# EAGLE design avr_keyboard_toy (EAGLE 7.7.0)
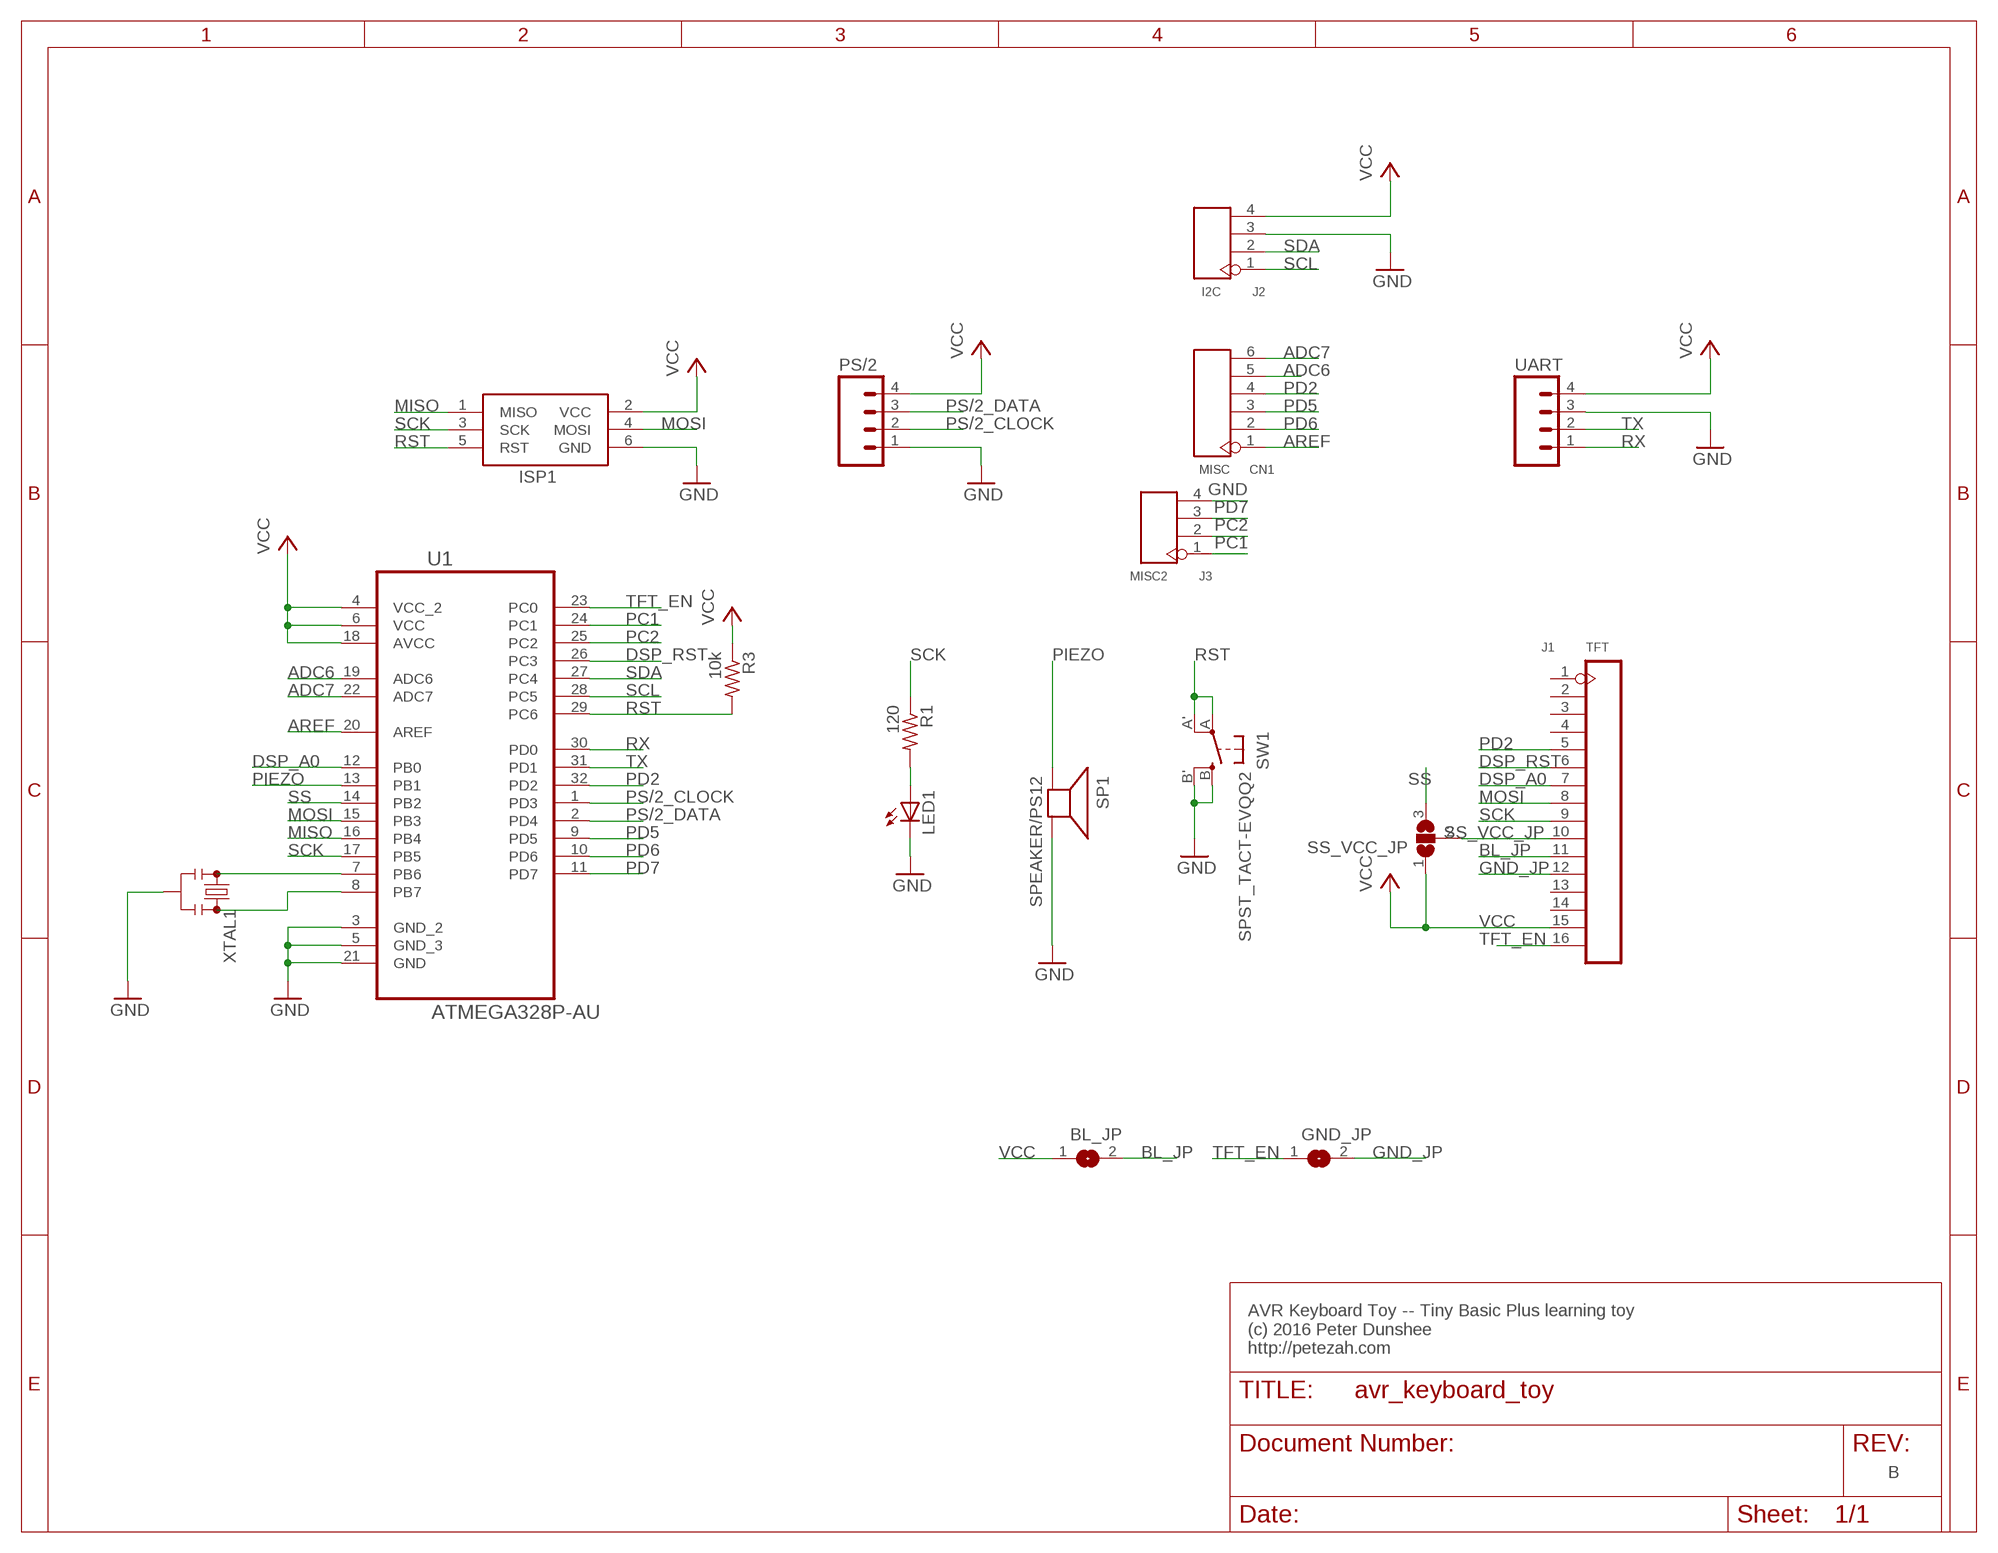
[diagram p0: schematic, sheet 1]

## Parts
BL_JP  SJ  [SJ]
CN1  MISC  DIP-BLACK-FEMALE-HEADER-VERT(6P-2.54)  [H6-2.54]
GND_JP  SJ  [SJ]
ISP1  AVRISP-6  [AVRISP]
J1  TFT  DIP-BLACK-FEMALE-HEADER-VERT(16P-2.54)  [H16-2.54]
J2  I2C  DIP-BLACK-FEMALE-HEADER-VERT(4P-2.54)  [H4-2.54]
J3  MISC2  DIP-BLACK-FEMALE-HEADER-VERT(4P-2.54)  [H4-2.54]
LED1  LEDCHIPLED_1206  [CHIPLED_1206]
PS/2  M04PTH  [1X04]
R1  120  R-US_R1206  [R1206]
R3  10k  R-US_R1206  [R1206]
SP1  SPEAKER/PS12  [PS12]
SS_VCC_JP  SJ2W  [SJ_2]
SW1  SPST_TACT-EVQQ2  [EVQ-Q2]
U1  ATMEGA328P-AU  [QFP80P900X900X120-32N]
UART  M04PTH  [1X04]
XTAL1  RESONATORPTH  [RESONATOR-PTH]

## Nets
ADC6: CN1.5 U1.19(ADC6)
ADC7: CN1.6 U1.22(ADC7)
AREF: CN1.1 U1.20(AREF)
BL_JP: BL_JP.2 J1.11
DSP_A0: J1.7 U1.12(PB0)
DSP_RST: J1.6 U1.26(PC3)
GND: ISP1.6(GND) J2.3 J3.4 LED1.C PS/2.1 SP1.P$2(-) SW1.B'(S1) SW1.B(S) U1.3(GND_2) U1.5(GND_3) U1.21(GND) UART.3 XTAL1.2
GND_JP: GND_JP.2 J1.12
MISO: ISP1.1(MISO) U1.16(PB4)
MOSI: ISP1.4(MOSI) J1.8 U1.15(PB3)
N$1: U1.7(PB6) XTAL1.1
N$2: U1.8(PB7) XTAL1.3
N$3: LED1.A R1.2
PC1: J3.1 U1.24(PC1)
PC2: J3.2 U1.25(PC2)
PD2: CN1.4 J1.5 U1.32(PD2)
PD5: CN1.3 U1.9(PD5)
PD6: CN1.2 U1.10(PD6)
PD7: J3.3 U1.11(PD7)
PIEZO: SP1.P$1(+) U1.13(PB1)
PS/2_CLOCK: PS/2.2 U1.1(PD3)
PS/2_DATA: PS/2.3 U1.2(PD4)
RST: ISP1.5(RST) R3.2 SW1.A'(P1) SW1.A(P) U1.29(PC6)
RX: U1.30(PD0) UART.1
SCK: ISP1.3(SCK) J1.9 R1.1 U1.17(PB5)
SCL: J2.1 U1.28(PC5)
SDA: J2.2 U1.27(PC4)
SS: SS_VCC_JP.3 U1.14(PB2)
SS_VCC_JP: J1.10 SS_VCC_JP.2
TFT_EN: GND_JP.1 J1.16 U1.23(PC0)
TX: U1.31(PD1) UART.2
VCC: BL_JP.1 ISP1.2(VCC) J1.15 J2.4 PS/2.4 R3.1 SS_VCC_JP.1 U1.4(VCC_2) U1.6(VCC) U1.18(AVCC) UART.4
Unconnected: J1.1 J1.2 J1.3 J1.4 J1.13 J1.14

## Notes on the sheet
- AVR Keyboard Toy -- Tiny Basic Plus learning toy
  (c) 2016 Peter Dunshee
  http://petezah.com
- B

## Library data of the parts
BL_JP GND_JP = jumper:SJ: SMD solder JUMPER
CN1 = Seeed-Connector -2016:DIP-BLACK-FEMALE-HEADER-VERT(6P-2.54): 320030060; MPN: F185-1106A1BSYC1; VALUE: 6p-2.54
ISP1 = adafruit:AVRISP: AVR ISP HEADER Standard 6 pin header for AVR programming
J1 = Seeed-OPL-Connector:DIP-BLACK-FEMALE-HEADER-VERT(16P-2.54): 320030078; MPN: F185-1116A0BSYA1; VALUE: black-16p-2.54
J2 J3 = Seeed-Connector -2016:DIP-BLACK-FEMALE-HEADER-VERT(4P-2.54): 320030017; MPN: F185-1104A1BSYA1; VALUE: 4p-2.54
LED1 = adafruit:LED: LED OSRAM: - CHIPLED LG R971, LG N971, LY N971, LG Q971, LY Q971, LO R971, LY R971 LH N974, LH R974 LS Q976, LO Q976, LY Q976 LO Q996 - Hyper CHIPLED LW Q18S LB Q993, LB Q99A, LB R99A - SideLED LS A670, LO A670, LY A670, LG A670, LP A670 LB A673, LV A673, LT A673, LW A673 LH A674 LY A675 LS A676, LA A676, LO A676, LY A676, LW A676 LS A679, LY A679, LG A679 - Hyper Micro SIDELED® LS Y876, LA Y876, LO Y876, LY Y876 LT Y87S - SmartLED LW L88C, LW L88S LB L89C, LB L89S, LG L890 LS L89K, LO L89K, LY L89K LS L896, LA L896, LO L896, LY L896 - TOPLED LS T670, LO T670, LY T670, LG T670, LP T670 LSG T670, LSP T670, LSY T670, LOP T670, LYG T670 LG T671, LOG T671, LSG T671 LB T673, LV T673, LT T673, LW T673 LH T674 LS T676, LA T676, LO T676, LY T676, LB T676, LH T676, LSB T676, LW T676 LB T67C, LV T67C, LT T67C, LS T67K, LO T67K, LY T67K, LW E67C LS E67B, LA E67B, LO E67B, LY E67B, LB E67C, LV E67C, LT E67C LW T67C LS T679, LY T679, LG T679 LS T770, LO T770, LY T770, LG T770, LP T770 LB T773, LV T773, LT T773, LW T773 LH T774 LS E675, LA E675, LY E675, LS T675 LS T776, LA T776, LO T776, LY T776, LB T776 LHGB T686 LT T68C, LB T68C - Hyper Mini TOPLED® LB M676 - Mini TOPLED Santana® LG M470 LS M47K, LO M47K, LY M47K Source: http://www.osram.convergy.de/
PS/2 UART = SparkFun-Connectors:M04: Header 4 Standard 4-pin 0.1" header. Use with straight break away headers (SKU : PRT-00116), right angle break away headers (PRT-00553), swiss pins (PRT-00743), machine pins (PRT-00117), and female headers (PRT-00115). Molex polarized connector foot print use with SKU : PRT-08231 with associated crimp pins and housings. 1MM SMD Version SKU: PRT-10208; PROD_ID: CONN-09696
R1 R3 = adafruit:R-US_: RESISTOR, American symbol
SP1 = adafruit:SPEAKER: SPEAKER Source: Buerklin Added PS12 (for part # PS1240 piezo) http://www.ladyada.net/library/pcb/eaglelibrary.html
SS_VCC_JP = jumper:SJ2W: SMD solder JUMPER
SW1 = adafruit:SPST_TACT: SMT 6mm switch, EVQQ2 series http://www.ladyada.net/library/eagle
U1 = Atmel_By_element14_Batch_1-00:ATMEGA328P-AU: 8-bit Microcontroller with In-System Programmable Flash; MPN: ATMEGA328P-AU; OC_FARNELL: 1715486; OC_NEWARK: 14R4631; PACKAGE: TQFP-32; SUPPLIER: Atmel
XTAL1 = SparkFun-FreqCtrl:RESONATOR: Resonator Small SMD resonator. Used, eg, on the Arduino Pro/ Pro Mini boards. 8MHz- XTAL-08895 16MHz- XTAL-08900

## Board
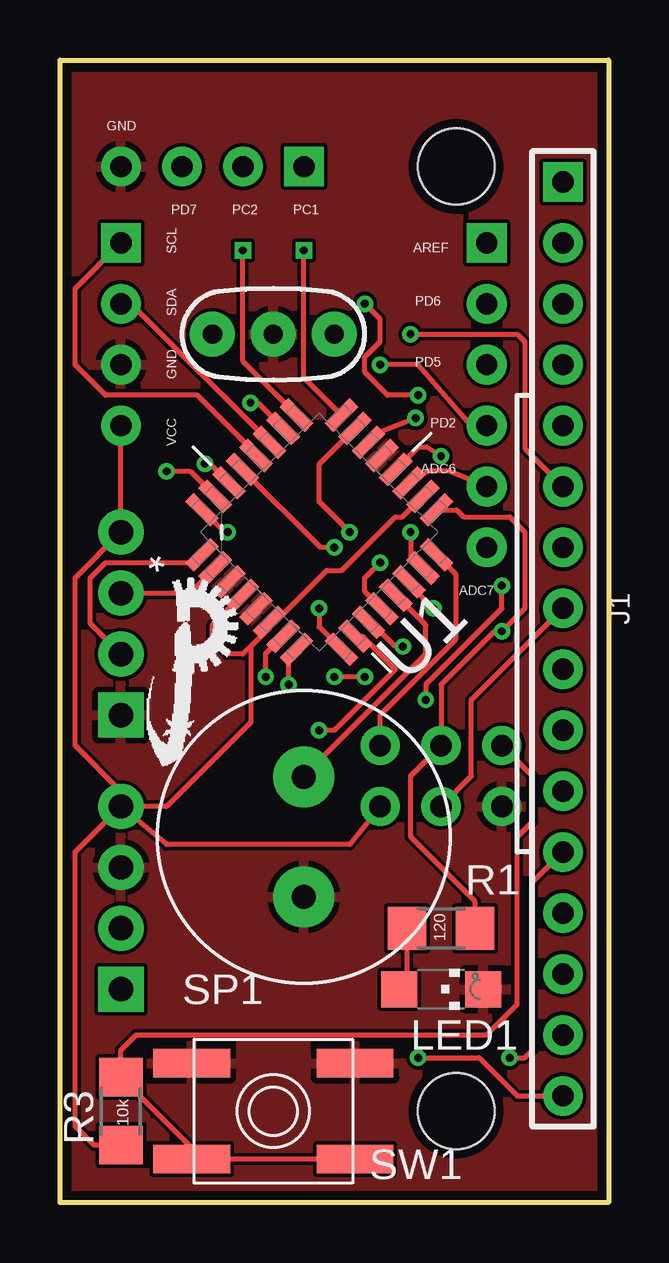
[diagram p1: board, top side]
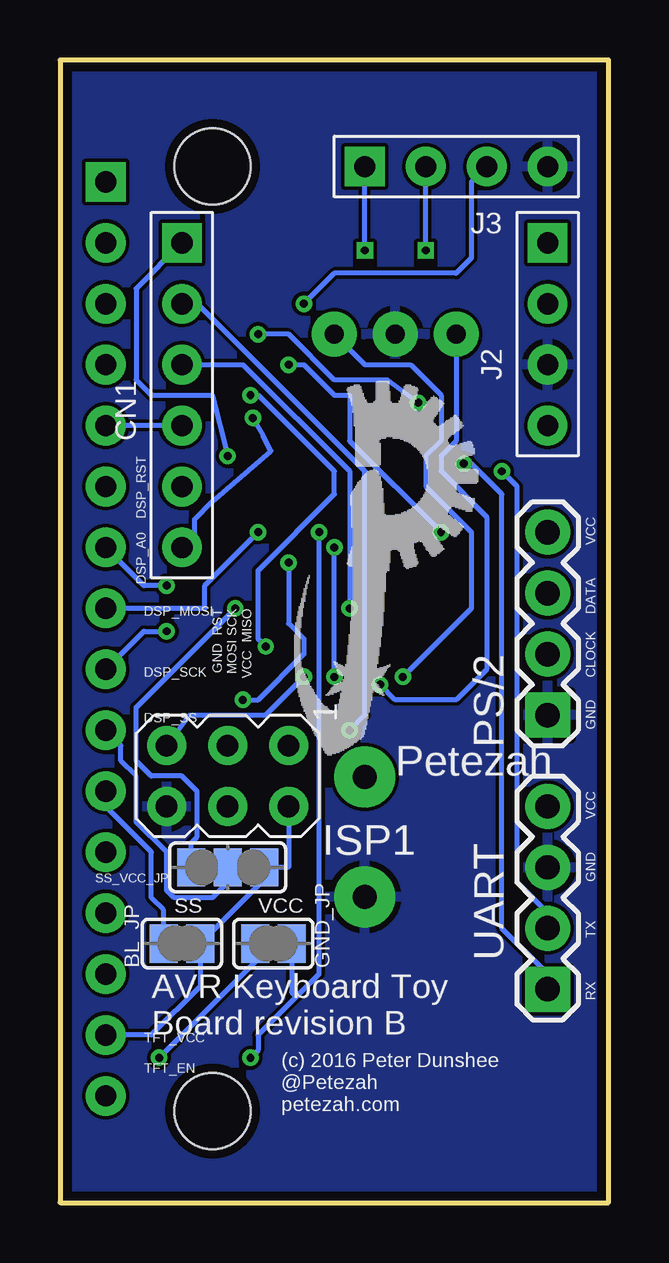
[diagram p2: board, bottom side, seen from below]

Size 22.86 x 47.62 mm. Coordinates in mm from the lower left corner, seen from the top.
Outline: 0,47.62 22.86,47.62 22.86,0 0,0 0,47.62
Copper layers (1*16): Top 0.0356mm / dielectric 1.5011mm / Bottom 0.0356mm
Design rules "oshpark-2layer": minimum track width 6mil, minimum drill 13mil, track to track 6mil, track to pad 6mil, pad to pad 6mil, via to via 6mil, smd to smd 6mil, copper to edge 15mil, drill to drill 6mil, minimum pad ring 7mil, minimum via ring 7mil, stop-mask expansion 2.5mil, vias tented up to drill 0mil, thermal gap 10mil
Holes 3.17 mm at 16.51,3.81 16.51,43.18

### Footprints (pad centres in the part's own frame; a part is rotated, then mirrored left to right if it is on the bottom)
SJ = smd 1.168 x 1.6: 1 -0.762,0; 2 0.762,0
H6-2.54 = drill 0.889 pad 1.651 square: 1 0,6.35 | drill 0.889 pad 1.651: 2 0,3.81; 3 0,1.27; 4 0,-1.27; 5 0,-3.81; 6 0,-6.35
AVRISP = drill 0.9 pad 1.626: 1 -1.27,2.54; 2 1.27,2.54; 3 -1.27,0; 4 1.27,0; 5 -1.27,-2.54; 6 1.27,-2.54
H16-2.54 = drill 0.889 pad 1.651 square: 1 0,-19.05 | drill 0.889 pad 1.651: 2 0,-16.51; 3 0,-13.97; 4 0,-11.43; 5 0,-8.89; 6 0,-6.35; 7 0,-3.81; 8 0,-1.27; 9 0,1.27; 10 0,3.81; 11 0,6.35; 12 0,8.89; 13 0,11.43; 14 0,13.97; 15 0,16.51; 16 0,19.05
H4-2.54 = drill 0.889 pad 1.651 square: 1 0,3.81 | drill 0.889 pad 1.651: 2 0,1.27; 3 0,-1.27; 4 0,-3.81
CHIPLED_1206 = smd 1.5 x 1.5: A 0,-1.75; C 0,1.75
1X04 = drill 1.016 pad 1.88 square: 1 0,0 | drill 1.016 pad 1.88: 2 2.54,0; 3 5.08,0; 4 7.62,0
R1206 = smd 1.6 x 1.803: 1 -1.422,0; 2 1.422,0
PS12 = drill 1 pad 2.54: P$1 -2.5,0; P$2 2.5,0
SJ_2 = smd 1.168 x 1.6: 1 -1.524,0; 2 0,0; 3 1.524,0
EVQ-Q2 = smd 3.2 x 1.2: A -3.4,-2; A' 3.4,-2; B -3.4,2; B' 3.4,2
QFP80P900X900X120-32N = smd 1.473 x 0.508: 1 -4.115,2.794; 2 -4.115,2.007; 3 -4.115,1.194; 4 -4.115,0.406; 5 -4.115,-0.406; 6 -4.115,-1.194; 7 -4.115,-2.007; 8 -4.115,-2.794; 17 4.115,-2.794; 18 4.115,-2.007; 19 4.115,-1.194; 20 4.115,-0.406; 21 4.115,0.406; 22 4.115,1.194; 23 4.115,2.007; 24 4.115,2.794 | smd 0.508 x 1.473: 9 -2.794,-4.115; 10 -2.007,-4.115; 11 -1.194,-4.115; 12 -0.406,-4.115; 13 0.406,-4.115; 14 1.194,-4.115; 15 2.007,-4.115; 16 2.794,-4.115; 25 2.794,4.115; 26 2.007,4.115; 27 1.194,4.115; 28 0.406,4.115; 29 -0.406,4.115; 30 -1.194,4.115; 31 -2.007,4.115; 32 -2.794,4.115
RESONATOR-PTH = drill 0.8 pad 1.88: 1 -2.54,0; 2 0,0; 3 2.54,0

### Placement (x,y rotation side)
BL_JP  17.78,10.79 180 bottom
CN1  17.78,33.66 0 bottom
GND_JP  13.97,10.79 180 bottom
ISP1  15.88,17.78 270 bottom
J1  20.95,23.5 180 top
J2  2.54,36.2 0 bottom
J3  6.35,43.18 90 bottom
LED1  15.88,8.89 270 top
PS/2  2.54,20.32 90 bottom
R1  15.88,11.43 180 top
R3  2.54,3.81 90 top
SP1  10.16,15.24 270 top
SS_VCC_JP  15.88,13.97 180 bottom
SW1  8.89,3.81 0 top
U1  10.79,27.94 45 top
U$1  [LOGO_TINY]  3.49,18.1 0 top
U$2  [LOGO_SM]  13.33,18.41 0 bottom
UART  2.54,8.89 90 bottom
XTAL1  8.89,36.2 180 top

### Tracks (layer width: path | path; a pad name or v marks a point on that pad's centre or on a via)
ADC6
  Top 0.203: CN1.5 16.19,30.48 15.34,30.48 U1.19
ADC7  (via drill 0.33)
  Top 0.203: v14.82,32.7 13.23,32.07 U1.22
  Bottom 0.203: CN1.6 17.25,27.3 17.25,28.47 16.51,29.21 | 16.51,29.21 | 16.51,29.21 14.08,31.32 14.4,31.96 v14.82,32.7
AREF  (via drill 0.33)
  Top 0.203: U1.20 14.92,31.49 15.3,31.49 v15.88,31.11
  Bottom 0.203: CN1.1 19.69,38.1 19.69,34.29 19.05,33.66 16.51,33.66 v15.88,31.11
BL_JP
  Bottom 0.203: BL_JP.2 18.54,12.19 19.05,12.7 19.05,14.61 20.95,16.51 J1.11
DSP_A0  (via drill 0.33)
  Top 0.203: v15.24,20.95 15.24,21.59 18.41,24.77 v18.41,25.72 | U1.12 12.7,25.46 12.7,26.04 v13.33,26.67
  Bottom 0.203: v15.24,20.95 14.6,20.95 12.7,22.86 12.7,23.5 13.33,24.13 v13.33,26.67 | v18.41,25.72 19.37,25.72 J1.7
DSP_RST  (via drill 0.33)
  Top 0.203: 9.3,32.29 U1.26 8.23,33.34 v7.94,33.34 | v14.6,36.2 19.05,36.2 19.37,35.88 19.37,31.43 J1.6
  Bottom 0.203: v7.94,33.34 9.21,34.29 11.43,34.29 13.33,36.2 v14.6,36.2
GND
  pour Top: 0,47.62 22.86,47.62 22.86,0 0,0
  pour Bottom: 0,47.62 22.86,47.62 22.86,0 0,0
GND_JP  (via drill 0.33)
  Top 0.203: v18.73,6.03 19.37,6.03 19.69,6.35 19.69,13.34 J1.12
  Bottom 0.203: GND_JP.2 14.73,10.03 v18.73,6.03
MISO
  Top 0.203: ISP1.1 13.33,20.32 16.51,23.5 16.51,26.18 U1.16
MOSI  (via drill 0.33)
  Top 0.203: ISP1.4 17.14,17.78 17.14,20.95 J1.8 | 15.12,26.47 U1.15 14.6,26.97 v14.6,27.94
  Bottom 0.203: J1.8 16.83,24.77 16.83,25.72 v14.6,27.94
N$1  (via drill 0.33)
  Top 0.203: v8.57,21.91 8.57,22.88 U1.7
  Bottom 0.203: XTAL1.1 10.16,34.92 8.25,34.92 6.98,33.66 6.98,31.75 7.62,31.11 7.62,29.84 5.71,27.94 5.71,24.77 v8.57,21.91
N$2  (via drill 0.33)
  Top 0.203: v9.52,21.59 9.52,22.72 U1.8
  Bottom 0.203: XTAL1.3 6.35,31.75 6.98,31.11 6.98,30.48 5.08,28.57 5.08,22.23 6.35,20.95 8.89,20.95 v9.52,21.59
N$3
  Top 0.203: R1.2 14.45,9.22 LED1.A
PC1  (via drill 0.33)
  Top 0.203: U1.24 10.16,34.39 v10.16,39.69
  Bottom 0.203: v10.16,39.69 J3.1
PC2  (via drill 0.33)
  Top 0.203: U1.25 7.62,35.07 v7.62,39.69
  Bottom 0.203: v7.62,39.69 J3.2
PD2  (via drill 0.33)
  Top 0.203: CN1.4 17.14,32.38 14.92,34.92 v13.33,34.92 | v6.98,27.94 6.84,27.94 U1.32
  Bottom 0.203: v6.98,27.94 10.79,31.75 10.79,33.66 11.43,33.66 12.7,34.92 v13.33,34.92 | CN1.4 J1.5
PD5  (via drill 0.33)
  Top 0.203: v10.79,24.77 10.79,23.99 U1.9
  Bottom 0.203: CN1.3 15.24,34.92 10.79,30.48 v10.79,24.77
PD6  (via drill 0.33)
  Top 0.203: U1.10 12.58,23.61 13.97,22.23 11.43,19.68 v10.79,19.68
  Bottom 0.203: v10.79,19.68 10.16,20.32 10.16,30.48 17.14,37.47 CN1.2
PD7  (via drill 0.33)
  Top 0.203: U1.11 12.96,24.19 13.97,23.18 v14.29,23.18 | v14.92,33.66 13.65,33.66 12.7,34.61 12.7,35.24 13.33,35.88 13.33,36.83 v12.7,37.47
  Bottom 0.203: v14.29,23.18 14.6,23.5 14.6,26.35 11.43,29.53 11.43,30.48 14.6,33.66 v14.92,33.66 | J3.3 5.71,42.55 5.71,39.37 6.35,38.73 11.43,38.73 v12.7,37.47
PIEZO
  Top 0.203: SP1.P$1 10.16,17.78 15.24,22.86 15.24,24.07 U1.13
PS/2_CLOCK
  Top 0.203: PS/2.2 1.27,24.13 1.27,26.04 1.9,26.67 5.71,26.67 5.71,26.81 U1.1
PS/2_DATA
  Top 0.203: PS/2.3 5.42,25.4 U1.2
RST  (via drill 0.33)
  Top 0.203: SW1.A' SW1.A 5.49,2.28 R3.2 2.54,6.35 3.17,6.99 17.78,6.99 19.05,8.26 19.05,15.24 19.69,15.88 19.69,17.78 ISP1.5 | v12.7,21.91 v11.43,21.91 | v11.43,27.3 10.86,27.3 U1.29
  Bottom 0.203: ISP1.5 17.46,20.32 14.29,20.32 v12.7,21.91 | v11.43,21.91 v11.43,27.3
RX  (via drill 0.33)
  Top 0.203: v6.03,30.8 6.25,30.8 U1.30
  Bottom 0.203: UART.1 2.54,9.53 4.45,11.43 4.45,29.53 5.71,30.8 v6.03,30.8
SCK  (via drill 0.33)
  Top 0.203: U1.17 16.53,28.87 16.83,28.57 18.73,28.57 19.37,27.94 19.37,24.77 v18.41,23.81 18.1,23.81 15.88,21.59 ISP1.3 14.6,17.78 14.6,15.24 17.3,12.55 R1.1
  Bottom 0.203: J1.9 19.37,23.81 v18.41,23.81
SCL
  Top 0.203: J2.1 0.63,38.1 0.63,34.92 1.9,33.66 5.71,33.66 8.17,31.2 U1.28
SDA
  Top 0.203: J2.2 2.96,37.47 U1.27
SS  (via drill 0.33)
  Top 0.203: v15.56,24.77 14.92,25.4 14.92,25.5 U1.14
  Bottom 0.203: SS_VCC_JP.3 17.4,14.99 17.14,15.24 17.14,17.14 17.78,17.78 19.05,17.78 19.69,18.41 19.69,20.64 v15.56,24.77
SS_VCC_JP
  Bottom 0.203: 15.88,14.61 SS_VCC_JP.2 15.88,13.34 16.51,12.7 18.1,12.7 18.41,13.02 18.41,14.61 19.69,15.88 19.69,17.78 20.32,18.41 20.32,19.05 J1.10
TFT_EN  (via drill 0.33)
  Top 0.203: v12.06,27.94 10.79,29.21 10.79,30.78 U1.23 | v14.92,6.03 17.46,6.03 19.05,4.45 J1.16
  Bottom 0.203: 13.02,8.57 14.6,6.99 14.6,6.35 v14.92,6.03 | 13.02,8.57 12.06,9.53 v12.06,27.94 | GND_JP.1 13.21,8.76 13.02,8.57
TX  (via drill 0.33)
  Top 0.203: v4.45,30.48 5.42,30.48 U1.31
  Bottom 0.203: UART.2 2.54,12.06 3.81,13.34 3.81,29.84 v4.45,30.48
VCC
  Top 0.203: R3.1 1.42,2.39 0.63,3.17 0.63,14.61 UART.4 | UART.4 2.54,17.14 0.63,19.05 0.63,26.04 PS/2.4 J2.4 | ISP1.2 12.06,14.92 4.45,14.92 UART.4 | U1.18 14.27,28.57 13.97,28.57 11.75,26.35 11.11,26.35 8.95,24.19 U1.6 8.73,23.97 7.94,23.18 | 7.94,23.18 7.94,20 4.45,16.51 UART.4 | 7.94,23.18 7.62,22.86 6.98,22.86 6.35,23.5 6.35,24.07 U1.4
  Bottom 0.203: ISP1.2 13.33,13.97 SS_VCC_JP.1 14.35,13.46 BL_JP.1 17.02,9.02 19.05,6.99 J1.15

### Text on the board
tPlace: GND | PD7 | PC2 | PC1 | SCL | AREF | SDA | PD6 | GND | PD5 | VCC | PD2 | ADC6 | ADC7 | 120 | 10k
bPlace: DSP_RST | VCC | DSP_A0 | DATA | GND RST / MOSI SCK / VCC MISO | CLOCK | DSP_MOSI | DSP_SCK | GND | DSP_SS | Petezah | VCC | GND | TX | VCC | SS | RX | AVR Keyboard Toy / Board revision B | TFT_VCC | TFT_EN | (c) 2016 Peter Dunshee / @Petezah / petezah.com